# EAGLE design main (EAGLE 9.5.2)
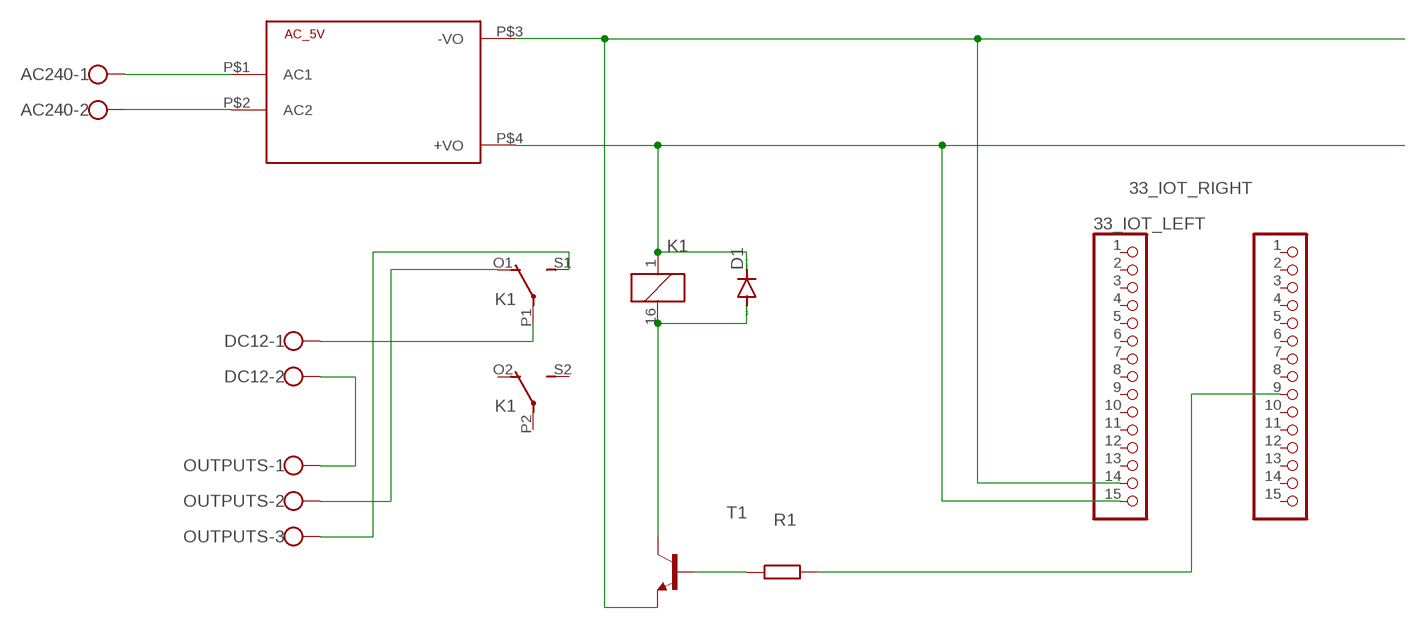
[diagram p0: schematic, sheet 1]

## Parts
33_IOT_LEFT  PINHD-1X15  [1X15]
33_IOT_RIGHT  PINHD-1X15  [1X15]
AC240  W237-102  [W237-102]
AC_5V  HLK-PM013W  [HLK-PM01]
D1  1N5060GP  [DO15-12]
DC12  W237-102  [W237-102]
K1  351  [351]
OUTPUTS  W237-103  [W237-103]
R1  R-EU_0207/10  [0207/10]
T1  2N2222  [TO18]

## Nets
N$1 [ac_power]: AC240.1 AC_5V.P$1(AC1)
N$2 [ac_power]: AC240.2 AC_5V.P$2(AC2)
N$3: R1.1 T1.2(B)
N$4: 33_IOT_LEFT.15 AC_5V.P$4(+VO) D1.C K1.1
N$5: D1.A K1.16 T1.3(C)
N$6: DC12.2 OUTPUTS.1
N$7: 33_IOT_LEFT.14 AC_5V.P$3(-VO) T1.1(E)
N$8: DC12.1 K1.P1(2:P)
N$9: K1.O1(2:O) OUTPUTS.2
N$10: K1.S1(2:S) OUTPUTS.3
N$13: 33_IOT_RIGHT.9 R1.2
Unconnected: 33_IOT_LEFT.1 33_IOT_LEFT.2 33_IOT_LEFT.3 33_IOT_LEFT.4 33_IOT_LEFT.5 33_IOT_LEFT.6 33_IOT_LEFT.7 33_IOT_LEFT.8 33_IOT_LEFT.9 33_IOT_LEFT.10 33_IOT_LEFT.11 33_IOT_LEFT.12 33_IOT_LEFT.13 33_IOT_RIGHT.1 33_IOT_RIGHT.2 33_IOT_RIGHT.3 33_IOT_RIGHT.4 33_IOT_RIGHT.5 33_IOT_RIGHT.6 33_IOT_RIGHT.7 33_IOT_RIGHT.8 33_IOT_RIGHT.10 33_IOT_RIGHT.11 33_IOT_RIGHT.12 33_IOT_RIGHT.13 33_IOT_RIGHT.14 33_IOT_RIGHT.15 K1.O2(3:O) K1.P2(3:P) K1.S2(3:S)

## Library data of the parts
33_IOT_LEFT 33_IOT_RIGHT = pinhead:PINHD-1X15: PIN HEADER
AC240 DC12 = con-wago-500:W237-102: WAGO SCREW CLAMP; MPN: 237-102; OC_FARNELL: unknown; OC_NEWARK: 70K9898
AC_5V = HLK-PM01:HLK-PM01: Hi-Link Power Supply HLK-PM01 3W Author: Ahmed Said <https://github.com/AhmedSaid/EAGLELibraries>
D1 = diode:1N5060GP: DIODE controlled avalanche rectifier
K1 = relay:351: RELAY 2 x switch, Omron; OC_FARNELL: unknown; OC_NEWARK: unknown
OUTPUTS = con-wago-500:W237-103: WAGO SCREW CLAMP; MPN: 237-103; OC_FARNELL: unknown; OC_NEWARK: 18M7116
R1 = rcl:R-EU_: RESISTOR, European symbol; SPICEPREFIX: R
T1 = transistor:2N2222: NPN TRANSISTOR

## Net classes
0 default: width 0.305 mm, drill 0.508 mm, clearance 0.254 mm
1 ac_power: width 0.305 mm, drill 0.508 mm, clearance 0.254 mm

## Board
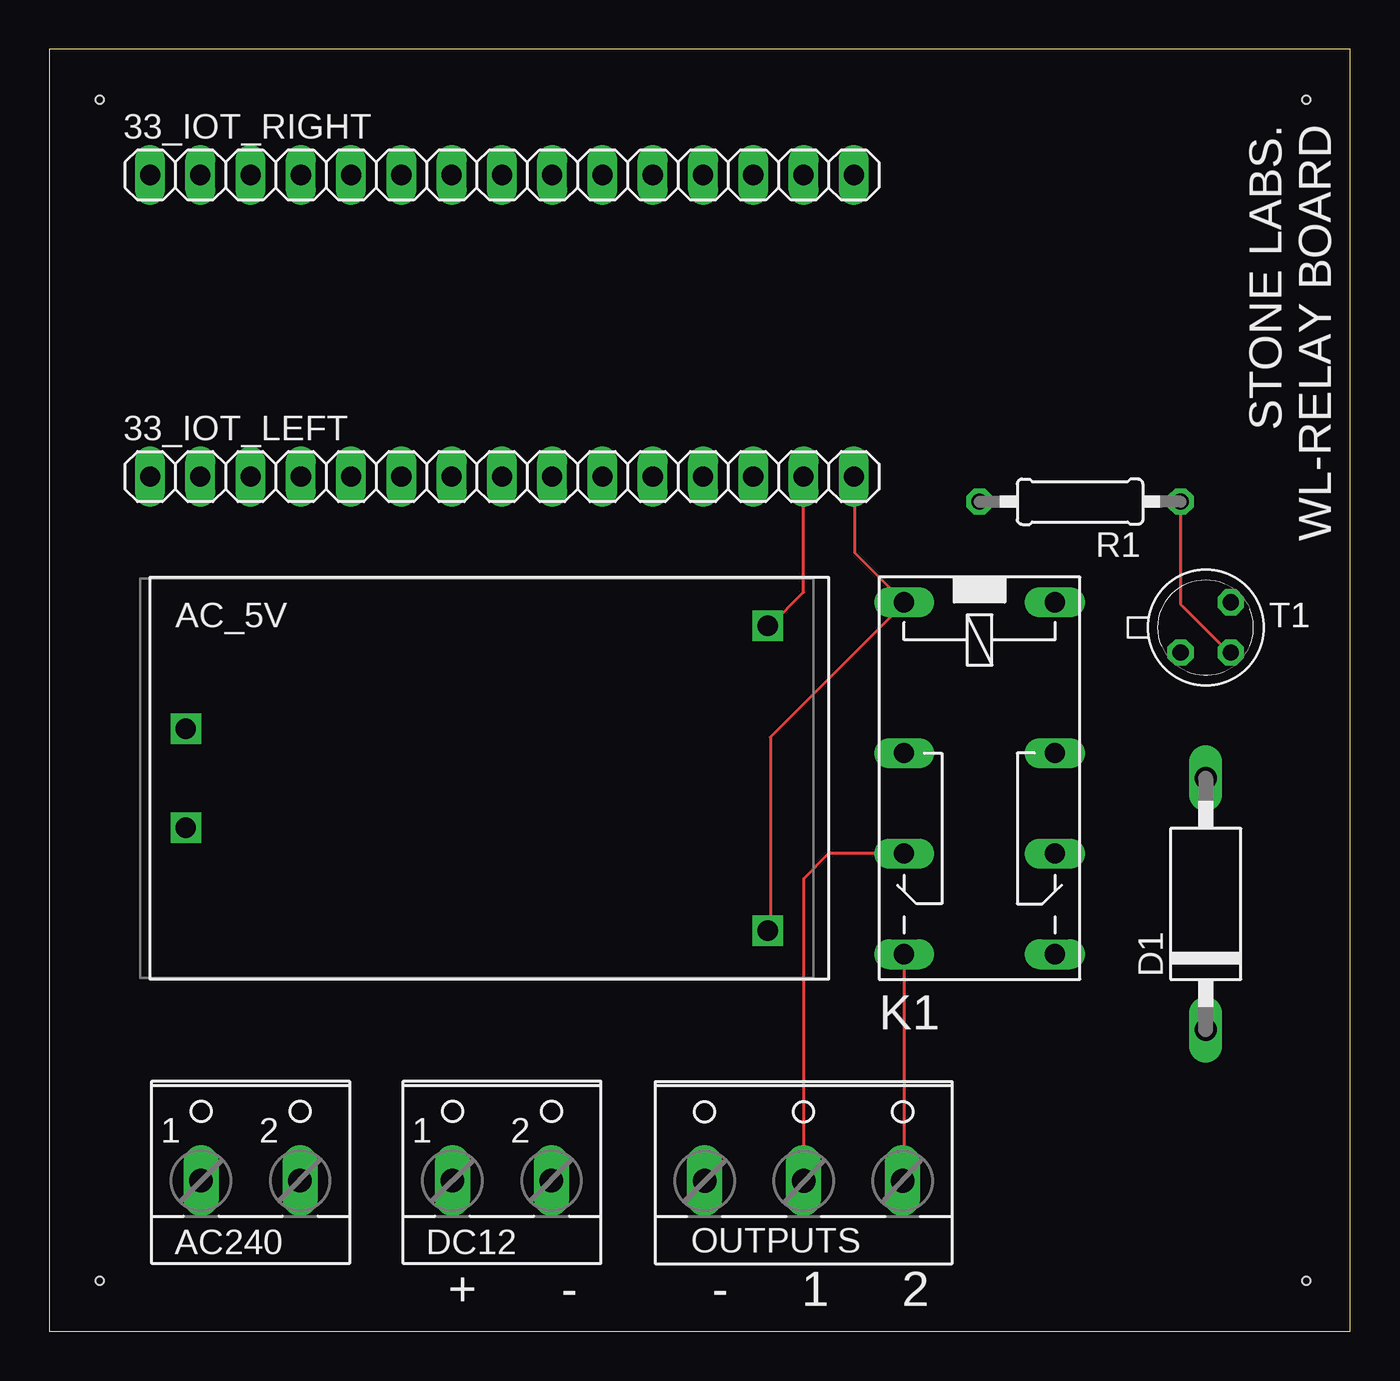
[diagram p1: board, top side]
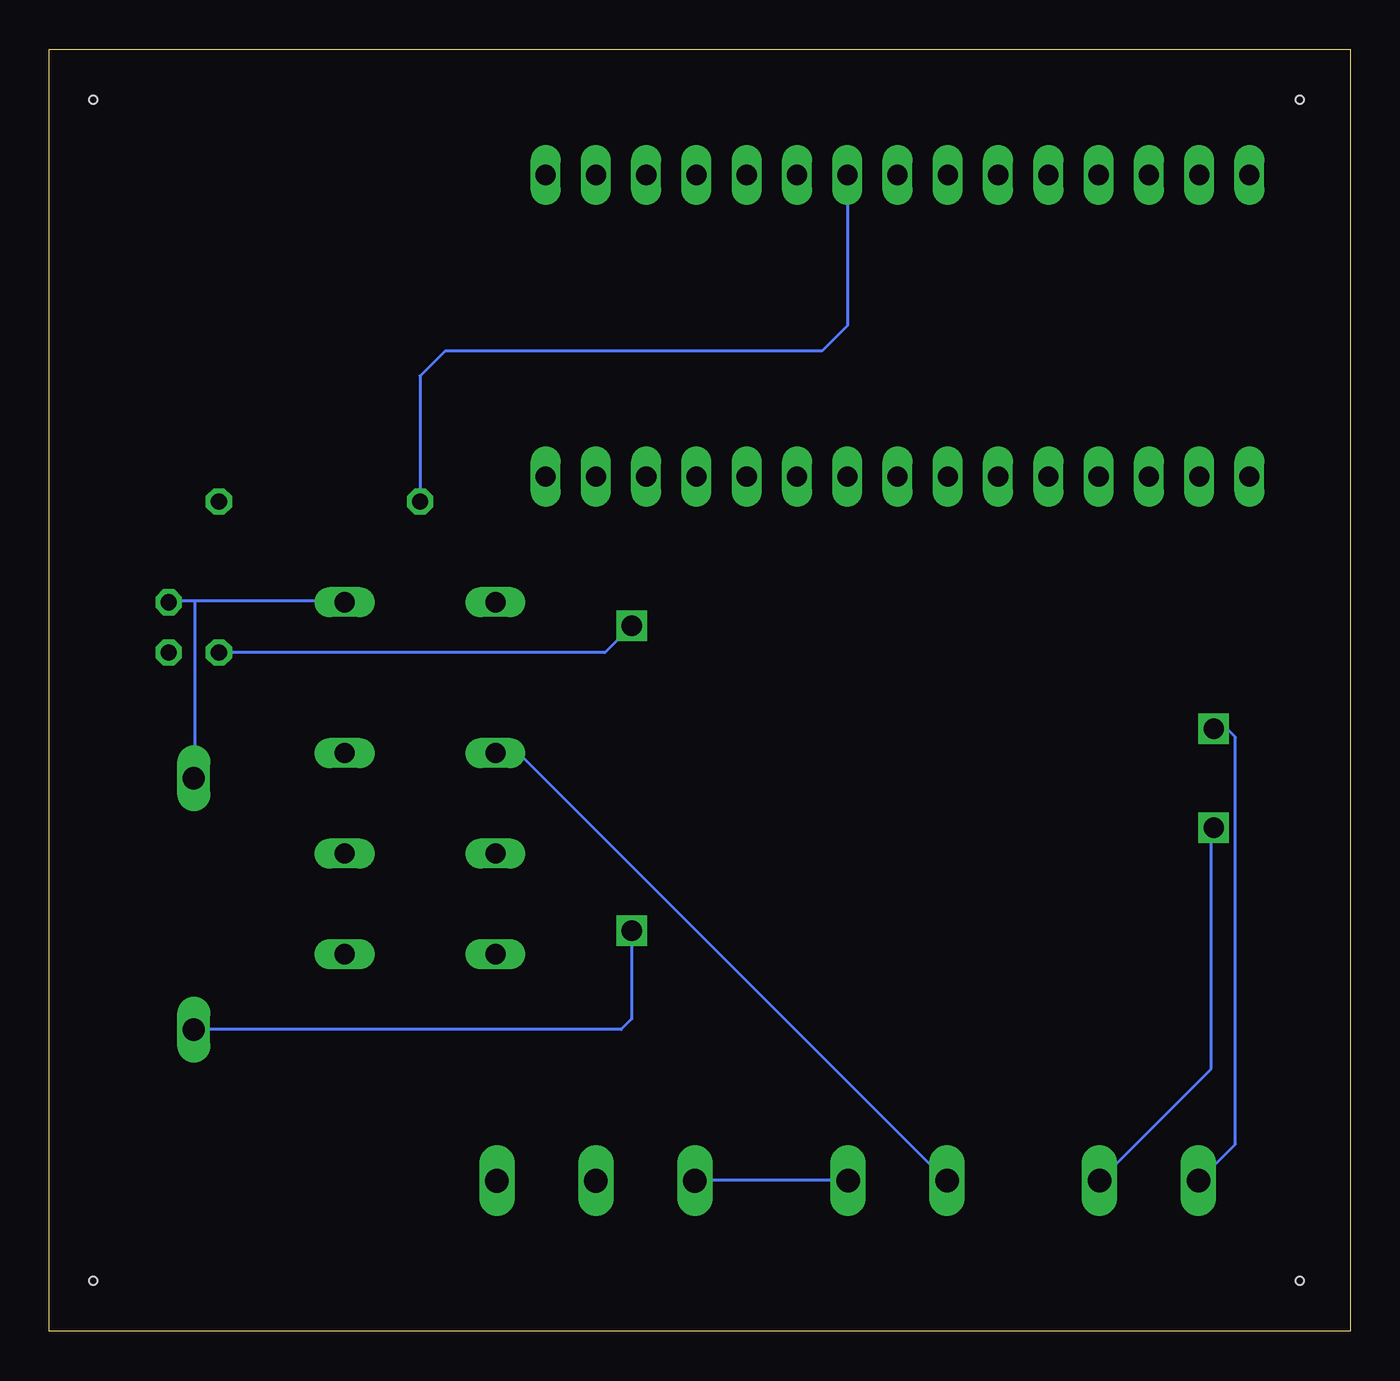
[diagram p2: board, bottom side, seen from below]

Size 65.71 x 64.76 mm. Coordinates in mm from the lower left corner, seen from the top.
Outline: 0,0 65.71,0 65.71,64.76 0,64.76 0,0
Copper layers (1*16): Top 0.035mm / dielectric 1.5mm / Bottom 0.035mm
Design rules "default": minimum track width 6mil, minimum drill 0.35mm, track to track 6mil, track to pad 6mil, pad to pad 6mil, via to via 6mil, smd to smd 6mil, copper to edge 40mil, drill to drill 6mil, minimum pad ring 10mil, minimum via ring 8mil, stop-mask expansion 4mil, vias tented up to drill 0mil, thermal gap 10mil
Holes 0.4 mm at 63.5,62.23 63.5,2.54 2.54,2.54 2.54,62.23

### Footprints (pad centres in the part's own frame; a part is rotated, then mirrored left to right if it is on the bottom)
1X15 = drill 1.016 long: 1 -17.78,0; 2 -15.24,0; 3 -12.7,0; 4 -10.16,0; 5 -7.62,0; 6 -5.08,0; 7 -2.54,0; 8 0,0; 9 2.54,0; 10 5.08,0; 11 7.62,0; 12 10.16,0; 13 12.7,0; 14 15.24,0; 15 17.78,0
W237-102 = drill 1.194 long: 1 -2.5,-1.27; 2 2.5,-1.27
HLK-PM01 = drill 1.016 square: P$1 -14.7,2.5; P$2 -14.7,-2.5; P$3 14.7,7.7; P$4 14.7,-7.7
DO15-12 = drill 1.118 long: A 6.35,0; C -6.35,0
351 = drill 1.016 long: 1 -3.81,-3.81; 16 -3.81,3.81; O1 8.89,-3.81; O2 8.89,3.81; P1 3.81,-3.81; P2 3.81,3.81; S1 13.97,-3.81; S2 13.97,3.81
W237-103 = drill 1.194 long: 1 -5,-1.29; 2 0,-1.29; 3 5,-1.29
0207/10 = drill 0.813 octagon: 1 -5.08,0; 2 5.08,0
TO18 = drill 0.813 octagon: 1 -1.27,-1.27; 2 1.27,-1.27; 3 1.27,1.27

### Placement (x,y rotation side)
33_IOT_LEFT  22.86,43.18 0 top
33_IOT_RIGHT  22.86,58.42 0 top
AC240  10.16,8.89 0 top
AC_5V  21.59,27.94 0 top
D1  58.42,21.59 90 top
DC12  22.86,8.89 0 top
K1  46.99,33.02 270 top
OUTPUTS  38.1,8.89 0 top
R1  52.07,41.91 180 top
T1  58.42,35.56 0 top

### Tracks (layer width: path | path; a pad name or v marks a point on that pad's centre or on a via)
N$1
  Bottom 0.152: AC_5V.P$1 6.21,30.44 5.79,30.02 5.79,9.45 7.62,7.62 AC240.1
N$2
  Bottom 0.152: AC_5V.P$2 7.01,25.3 7.01,13.26 12.65,7.62 AC240.2
N$3
  Top 0.152: R1.1 57.15,36.73 59.59,34.29 T1.2
N$4
  Top 0.152: AC_5V.P$4 36.42,20.27 36.42,30.02 43.13,36.73 K1.1 40.69,39.32 40.69,43.13 33_IOT_LEFT.15
  Bottom 0.152: 36.42,20.12 AC_5V.P$4 36.29,15.78 36.83,15.24 D1.C
N$5
  Bottom 0.152: 58.37,36.88 50.9,36.88 K1.16 | 58.37,36.88 59.59,36.88 T1.3 | 58.37,36.88 58.37,28.04 D1.A
N$6
  Bottom 0.152: DC12.2 33.07,7.62 OUTPUTS.1
N$7
  Top 0.152: 33_IOT_LEFT.14 38.1,37.34 36.42,35.66 AC_5V.P$3
  Bottom 0.152: T1.1 37.64,34.29 36.42,35.51 AC_5V.P$3
N$8
  Bottom 0.152: K1.P1 43.13,29.11 41.91,29.11 20.42,7.62 DC12.1
N$9
  Top 0.152: K1.O1 39.37,24.13 38.1,22.86 OUTPUTS.2
  Bottom 0.152: 43.13,24.08 K1.O1
N$10
  Top 0.152: 43.13,19.05 K1.S1 43.18,7.68 OUTPUTS.3
N$13
  Bottom 0.152: 33_IOT_RIGHT.9 25.4,50.8 26.67,49.53 45.72,49.53 46.99,48.26 R1.2

### Text on the board
tNames: STONE LABS. / WL-RELAY BOARD | + | - | - | 1 | 2